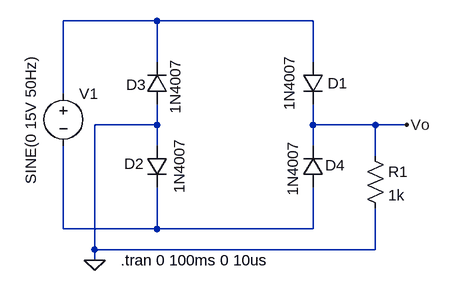
[diagram p0: schematic E3-rectificador-doble-onda-puente.asc]
E3-rectificador-doble-onda-puente.asc, the LTspice schematic file:
Version 4
SHEET 1 880 680
WIRE -1184 -80 -1328 -80
WIRE -944 -80 -1184 -80
WIRE -1184 -16 -1184 -80
WIRE -944 -16 -944 -80
WIRE -1328 32 -1328 -80
WIRE -1184 80 -1184 48
WIRE -1184 80 -1280 80
WIRE -944 80 -944 48
WIRE -848 80 -944 80
WIRE -800 80 -848 80
WIRE -1184 112 -1184 80
WIRE -944 112 -944 80
WIRE -848 128 -848 80
WIRE -1328 240 -1328 112
WIRE -1184 240 -1184 176
WIRE -1184 240 -1328 240
WIRE -944 240 -944 176
WIRE -944 240 -1184 240
WIRE -1280 272 -1280 80
WIRE -848 272 -848 208
WIRE -848 272 -1280 272
WIRE -1280 288 -1280 272
FLAG -1280 288 0
FLAG -800 80 Vo
SYMBOL voltage -1328 16 R0
WINDOW 3 -50 156 VLeft 2
WINDOW 123 0 0 Left 0
WINDOW 39 0 0 Left 0
SYMATTR Value SINE(0 15V 50Hz)
SYMATTR InstName V1
SYMBOL diode -928 -16 M0
WINDOW 0 -37 32 Left 2
WINDOW 3 52 -11 VRight 2
SYMATTR InstName D1
SYMATTR Value 1N4007
SYMBOL res -864 112 R0
SYMATTR InstName R1
SYMATTR Value 1k
SYMBOL diode -1168 112 M0
WINDOW 0 36 28 Left 2
WINDOW 3 -18 -11 VRight 2
SYMATTR InstName D2
SYMATTR Value 1N4007
SYMBOL diode -1200 48 M180
WINDOW 0 -31 30 Left 2
WINDOW 3 44 -15 VRight 2
SYMATTR InstName D3
SYMATTR Value 1N4007
SYMBOL diode -960 176 M180
WINDOW 0 35 34 Left 2
WINDOW 3 -15 -13 VRight 2
SYMATTR InstName D4
SYMATTR Value 1N4007
TEXT -1240 288 Left 2 !.tran 0 100ms 0 10us

The netlist it stands for:
* E3-rectificador-doble-onda-puente.asc
V1 N001 N002 SINE(0 15V 50Hz)
D1 N001 Vo 1N4007
R1 Vo 0 1k
D2 0 N002 1N4007
D3 0 N001 1N4007
D4 N002 Vo 1N4007
.model D D
.lib standard.dio
.tran 0 100ms 0 10us
.backanno
.end